# Altium project ESP32-Core.PrjPcb
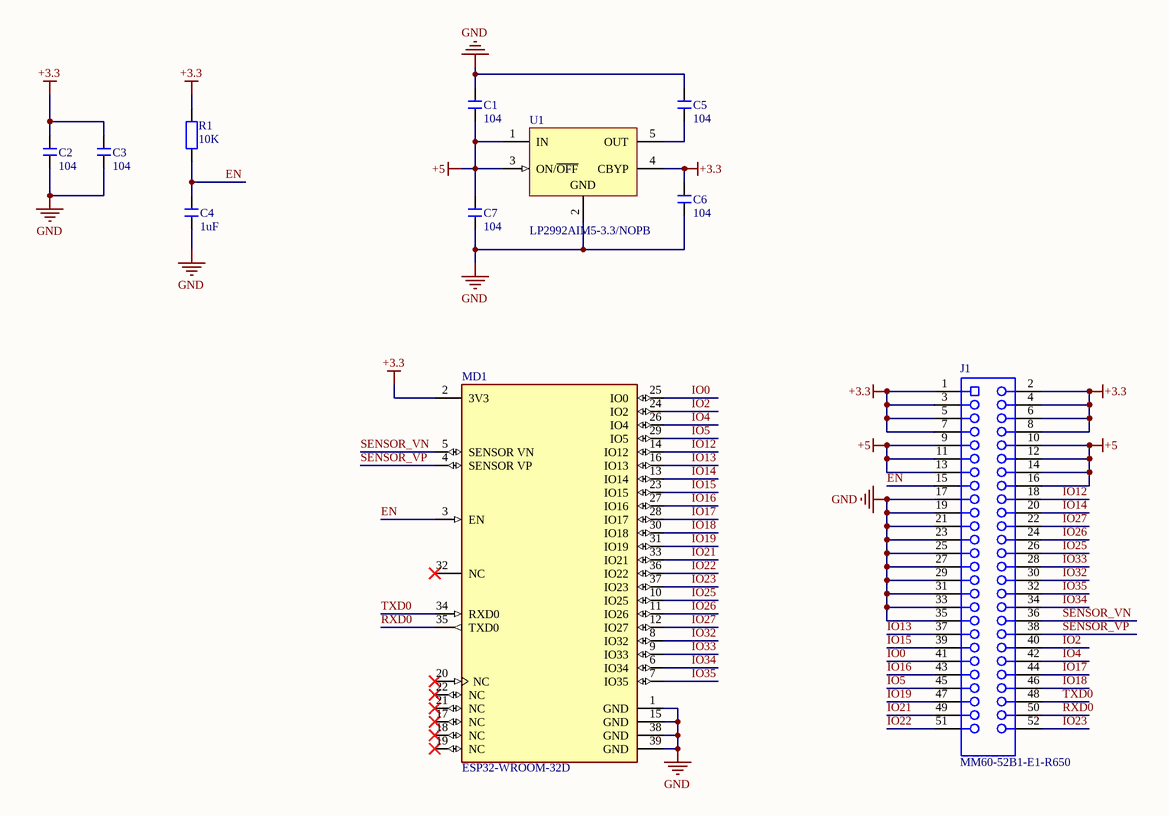
[diagram p0: ESP32-Core.SchDoc]
1 sheet, 11 parts. Net scope: global (net labels, ports and power ports of the same name join across sheets).
Board file: ESP32-Core.PcbDoc

## Sheet ESP32-Core.SchDoc
size A4; DocumentNumber: 1; SheetNumber: 1; SheetTotal: 1

### Parts
C1  104  [C 0603_L]
C2  104  [C 0603_L]
C3  104  [C 0603_L]
C4  1uF  [C 0603_L]
C5  104  [C 0603_L]
C6  104  [C 0603_L]
C7  104  [C 0603_L]
J1  MM60-52B1-E1-R650  [MINI_PCIE_GOLD_3130]
MD1  ESP32-WROOM-32D  [FP-ESP32-WROOM-32E]
R1  10K  [R 0603_L]
U1  LP2992AIM5-3.3/NOPB  [MF05A_L]

### Nets
+3.3: C2.2 C3.2 C6.2 J1.1 J1.2 J1.3 J1.4 J1.5 J1.6 J1.7 J1.8 MD1.2(3V3) R1.2 U1.4(CBYP)
+5: C1.1 C7.2 J1.9 J1.10 J1.11 J1.12 J1.13 J1.14 J1.16 U1.1(IN) U1.3(ON/~{OFF})
GND: C1.2 C2.1 C3.1 C4.1 C5.1 C6.1 C7.1 J1.17 J1.19 J1.21 J1.23 J1.25 J1.27 J1.29 J1.31 J1.33 J1.35 MD1.1(GND) MD1.15(GND) MD1.38(GND) MD1.39(GND) U1.2(GND)
EN: C4.2 J1.15 MD1.3(EN) R1.1
IO0: J1.41 MD1.25(IO0)
IO2: J1.40 MD1.24(IO2)
IO4: J1.42 MD1.26(IO4)
IO5: J1.45 MD1.29(IO5)
IO12: J1.18 MD1.14(IO12)
IO13: J1.37 MD1.16(IO13)
IO14: J1.20 MD1.13(IO14)
IO15: J1.39 MD1.23(IO15)
IO16: J1.43 MD1.27(IO16)
IO17: J1.44 MD1.28(IO17)
IO18: J1.46 MD1.30(IO18)
IO19: J1.47 MD1.31(IO19)
IO21: J1.49 MD1.33(IO21)
IO22: J1.51 MD1.36(IO22)
IO23: J1.52 MD1.37(IO23)
IO25: J1.26 MD1.10(IO25)
IO26: J1.24 MD1.11(IO26)
IO27: J1.22 MD1.12(IO27)
IO32: J1.30 MD1.8(IO32)
IO33: J1.28 MD1.9(IO33)
IO34: J1.34 MD1.6(IO34)
IO35: J1.32 MD1.7(IO35)
RXD0: J1.50 MD1.35(TXD0)
SENSOR_VN: J1.36 MD1.5(SENSOR_VN)
SENSOR_VP: J1.38 MD1.4(SENSOR_VP)
TXD0: J1.48 MD1.34(RXD0)
NetC5_2: C5.2 U1.5(OUT)

Not connected (* = marked no-connect by the designer): MD1 17(NC)* 18(NC)* 19(NC)* 20(NC)* 21(NC)* 22(NC)* 32(NC)*

### Library data of the parts
C1-C7 = C: 无极性贴片电容; 材质: X7R; BOM名称: 无极性贴片电容
J1 = MINI_PCIE_GOLD: Compatible with PCI Express Mini Card, 5.9 mm Height, -40 to 85 degC, 52-Pin SMD, RoHS, Tape and Reel; Manufacturer: JAE Electronics; Product Training Modules: MM60PCIeMiniCardConnectorMemoryModules,theSM3andMM60SeriesofConnectors; Pitch: 0.031"(0.80mm); Associated Product: 670-2277-2-ND-CONNMINIEXPRESSCARDLATCHSMD670-2277-1-ND-CONNMINIEXPRESSCARDLATCHSMD670-2277-6-ND-CONNMINIEXPRESSCARDLATCHSMD; Read Out: Dual; Other Names: 670-2275-6; Number of Positions: 52; Online Catalog: MM60Series; Other Related Documents: CardSelectionGuide; Package Version: Rev. 2, 01/2006; Material - Insulation: Thermoplastic; Catalog Drawings: MM60SeriesSideMM60SeriesTop; Gender: Female; Featured Product: MM60PCIeMiniCardConnector; Card Thickness: 0.039"(1.00mm); Number of Positions/Bay/Row: -; Category: Connectors,Interconnects; Termination: Solder; Series: MM60; Card Type: PCIExpressMiniCard; Flange Feature: -; Contact Type: -; Family: CardEdgeConnectors-EdgeboardConnectors; Package Reference: MM60-52B1; Manufacturer URL: http://www.jaeusa.com/; Contact Material: CopperAlloy; Mounting Technology: SurfaceMount; Operating Temperature: -40°C~85°C; Package URL: https://datasheet.ciiva.com/7633/332207-7633323.pdf; Contact Finish Thickness: 3.9µin(0.10µm); Datasheet Version: 04/2015; Datasheet URL: http://www.jae.com/z-en/pdf_download_exec.cfm?param=MB-0147-6E_MM60.pdf; Contact Finish: Gold; Standard Package: 1; Mounting Type: SurfaceMount,RightAngle; Packaging: Digi-Reel®; Number of Rows: 2; Color: -; Package Description: 52-Pin Surface Mount Device, Body 28.4 x 10 mm, Pitch 0.8 mm; Features: BoardGuide; Manufacturer Part Number: MM60-52B1-E1-R650
MD1 = ESP32-WROOM-32E: WIFI MODULE 32MBITS SPI FLASH; Manufacturer: Espressif Systems; Max Supply Voltage: 3.6V; Nominal Supply Current: 500mA; Max Frequency: 2484MHz; Number Of Adc Channels: 16; Number Of Gpio: 32; Interface: I2C,SPI,UART,Ethernet,I2S,Other; Data Rate: 150Mbits/s; Min Supply Voltage: 3V; Bandwidth: 72MHz; Sensitivity: -98dBm; Octopart: https://octopart.com/esp32-wroom-32d-espressif+systems-91040050; Package: ESP32-WROOM-32D; ComponentLink2URL: https://www.espressif.com/sites/default/files/documentation/esp32-wroom-32d_esp32-wroom-32u_datasheet_en.pdf; Lead Free: Yes; Category: UNK; Mouser Description: Wi-Fi/BT BLE Module ESP32-D0WD, SPI Flash, UART, P; Device Class L1: Integrated Circuits (ICs); RoHS: TRUE; Temperature Range Low: -40°C; ComponentLink2Description: Datasheet; Digikey Description: WIFI MODULE 32MBITS SPI FLASH; Height: 3.2mm; Temperature: -40°C to +85°C; Manufacturer Part Number: ESP32-WROOM-32D; Device Class L3: Transceivers; Device Class L2: RF Semiconductors and Devices; Temperature Range High: +85°C; Automotive: No
R1 = R: 贴片电阻; BOM名称: 贴片电阻
U1 = CMP-0062-02136-2: Micropower 250 mA Low-Noise Ultra Low-Dropout Regulator, 5-pin SOT-23, Pb-Free; Manufacturer: National Semiconductor; PowerWise: N; PackageTopMarking: LFEA*XTT; CompType: LDO IC; ComponentLink2Description: LP2992 Web Page; ComponentLink3Description: MF05A Package Page; PackageVersion: revD, Aug-2008; RoHS: Y; ComponentLink1Description: LP2992 Datasheet; DatasheetVersion: May-2005; PackageReference: MF05A; PackageDescription: Molded SOT-23, .115 x .063 x .040 in Body, 5 Lead, .0375 in Pitch; ComponentLink1URL: http://www.national.com/ds/LP/LP2992.pdf; ComponentLink3URL: http://www.national.com/packaging/folders/mf05a.html; RevisionNote: Component URLs added; PinCount: 5; ComponentLink2URL: http://www.national.com/pf/LP/LP2992.html